# Altium schematic sheet 02_ESP32-C3-MINI-1.SchDoc
size 297 x 209 mm
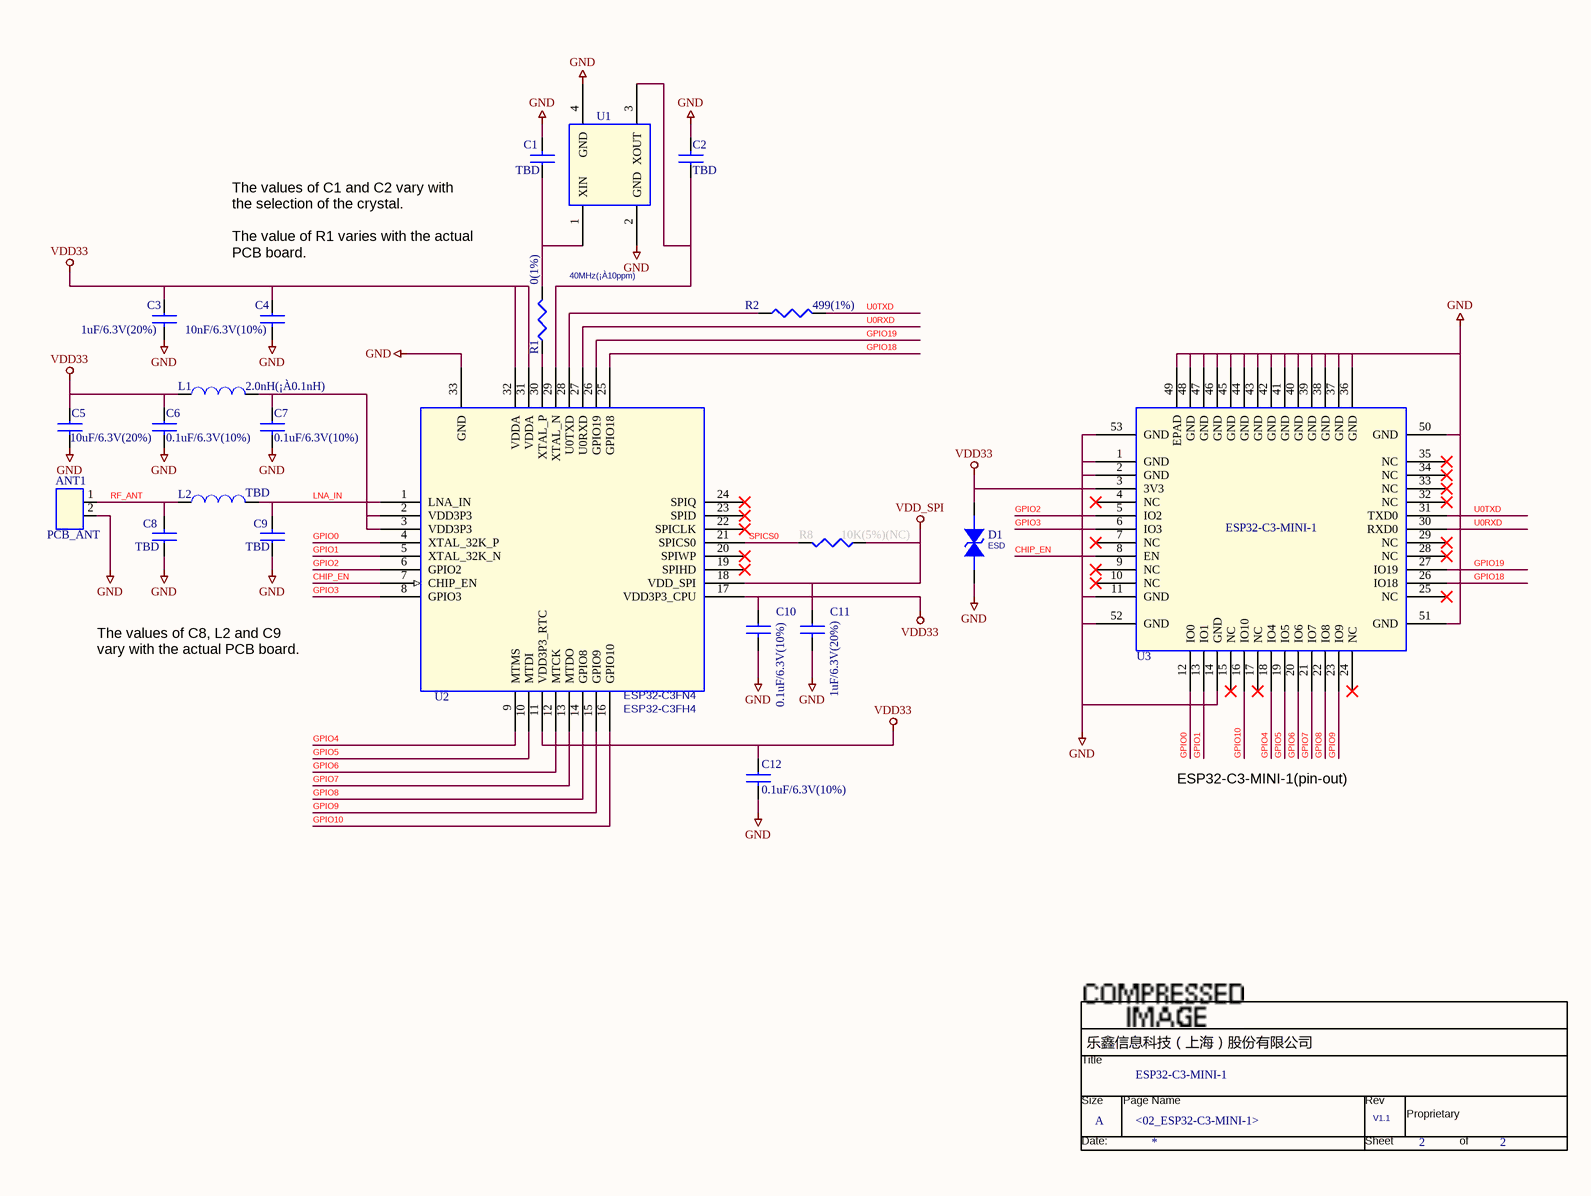
[diagram p0: 02_ESP32-C3-MINI-1.SchDoc, top left]
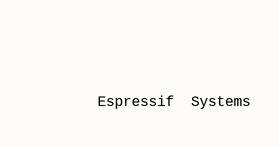
[diagram p1: 02_ESP32-C3-MINI-1.SchDoc, bottom right]

## Parts
*  Doc: <02_ESP32-C3-MINI-1>  Title: ESP32-C3-MINI-1  Page Size: A  Page Number: 2  RevCode: V1.1  (hidden comment: espTitleBlock3)  (graphical)
ANT1  PCB_ANT  [MINI-ANT-TYPED-H]
C1  TBD  [C0201]
C2  TBD  [C0201]
C3  1uF/6.3V(20%)  [C0201]
C4  10nF/6.3V(10%)  [C0201]
C5  10uF/6.3V(20%)  [C0402]
C6  0.1uF/6.3V(10%)  [C0201]
C7  0.1uF/6.3V(10%)  [C0201]
C8  TBD  [C0201]
C9  TBD  [C0201]
C10  0.1uF/6.3V(10%)  [C0201]
C11  1uF/6.3V(20%)  [C0201]
C12  0.1uF/6.3V(10%)  [C0201]
D1  ESD  [ESD0402]
L1  2.0nH(¡À0.1nH)  [L0201]
L2  TBD  [L0201]
R1  0(1%)  [R0201]
R2  499(1%)  [R0201]
R8  10K(5%)(NC)  [R0201]
U1  40MHz(¡À10ppm)  [XTAL3225]
U2  ESP32-C3FN4/ESP32-C3FH4  [QFN32_0P5_5]  (value not drawn)
U3  ESP32-C3-MINI-1  [QFN48_0P8_11P8X9P8]

## Nets
GND: ANT1.2 C1.2 C2.2 C3.2 C4.2 C5.2 C6.2 C7.2 C8.1 C9.1 C10.2 C11.2 C12.2 D1.2 U1.2(GND) U1.4(GND) U2.33(GND) U3.1(GND) U3.2(GND) U3.11(GND) U3.14(GND) U3.36(GND) U3.37(GND) U3.38(GND) U3.39(GND) U3.40(GND) U3.41(GND) U3.42(GND) U3.43(GND) U3.44(GND) U3.45(GND) U3.46(GND) U3.47(GND) U3.48(GND) U3.49(EPAD) U3.50(GND) U3.51(GND) U3.52(GND) U3.53(GND)
VDD33: C3.1 C4.1 C5.1 C6.1 C10.1 C12.1 D1.1 L1.2 U2.11(VDD3P3_RTC) U2.17(VDD3P3_CPU) U2.31(VDDA) U2.32(VDDA) U3.3(3V3)
VDD_SPI: C11.1 R8.2 U2.18(VDD_SPI)
CHIP_EN: U2.7(CHIP_EN) U3.8(EN)
GPIO0: U2.4(XTAL_32K_P) U3.12(IO0)
GPIO1: U2.5(XTAL_32K_N) U3.13(IO1)
GPIO2: U2.6(GPIO2) U3.5(IO2)
GPIO3: U2.8(GPIO3) U3.6(IO3)
GPIO4: U2.9(MTMS) U3.18(IO4)
GPIO5: U2.10(MTDI) U3.19(IO5)
GPIO6: U2.12(MTCK) U3.20(IO6)
GPIO7: U2.13(MTDO) U3.21(IO7)
GPIO8: U2.14(GPIO8) U3.22(IO8)
GPIO9: U2.15(GPIO9) U3.23(IO9)
GPIO10: U2.16(GPIO10) U3.16(IO10)
GPIO18: U2.25(GPIO18) U3.26(IO18)
GPIO19: U2.26(GPIO19) U3.27(IO19)
LNA_IN: C9.2 L2.1 U2.1(LNA_IN)
RF_ANT: ANT1.1 C8.2 L2.2
SPICS0: R8.1 U2.21(SPICS0)
U0RXD: U2.27(U0RXD) U3.30(RXD0)
U0TXD: R2.2 U3.31(TXD0)
NetC1_1: C1.1 R1.2 U1.1(XIN)
NetC2_1: C2.1 U1.3(XOUT) U2.29(XTAL_N)
NetC7_1: C7.1 L1.1 U2.2(VDD3P3) U2.3(VDD3P3)
NetR1_1: R1.1 U2.30(XTAL_P)
NetR2_1: R2.1 U2.28(U0TXD)

Not connected (* = marked no-connect by the designer): U2 19(SPIHD)* 20(SPIWP)* 22(SPICLK)* 23(SPID)* 24(SPIQ)*; U3 4(NC)* 7(NC)* 9(NC)* 10(NC)* 15(NC)* 17(NC)* 24(NC)* 25(NC)* 28(NC)* 29(NC)* 32(NC)* 33(NC)* 34(NC)* 35(NC)*

## Notes on the sheet
- The values of C1 and C2 vary with
  the selection of the crystal.
  The value of R1 varies with the actual
  PCB board.
- The values of C8, L2 and C9
  vary with the actual PCB board.
- (near U2) ESP32-C3FN4
- (near U2) ESP32-C3FH4
- ESP32-C3-MINI-1(pin-out)
- Espressif  Systems
- (in symbol espTitleBlock3) Title; Size; Page Name; Rev; Proprietary; Date:; Sheet; of

## Library data of the parts
* = espTitleBlock3: Page Name: V; Page Create Date: March  8, 1995; Page Count: 2; Page Modify Date: *
C1-C12 = CAP
  C1-C4 C6-C12: PCB Footprint: C0201
  C5: PCB Footprint: C0402
D1 = DIODE BI-DIR TRIG: PCB Footprint: SOD882; Options: ESD
L1 L2 = Inductor: PCB Footprint: L0201
R1 R2 R8 = RESISTOR_0: PCB Footprint: R0201
U1 = X1_1: PCB Footprint: XTAL3225
U2 = ESP32-C3: PCB Footprint: QFN32_0P5_5
ANT1 = PCB_ANT: PCB Footprint: MINI-ANT-TYPED-H
U3 = ESP32-C3-MINI-1: PCB Footprint: QFN48_0P8_11P8X9P8